# EAGLE design BEATS_3.6 (EAGLE 9.6.2)
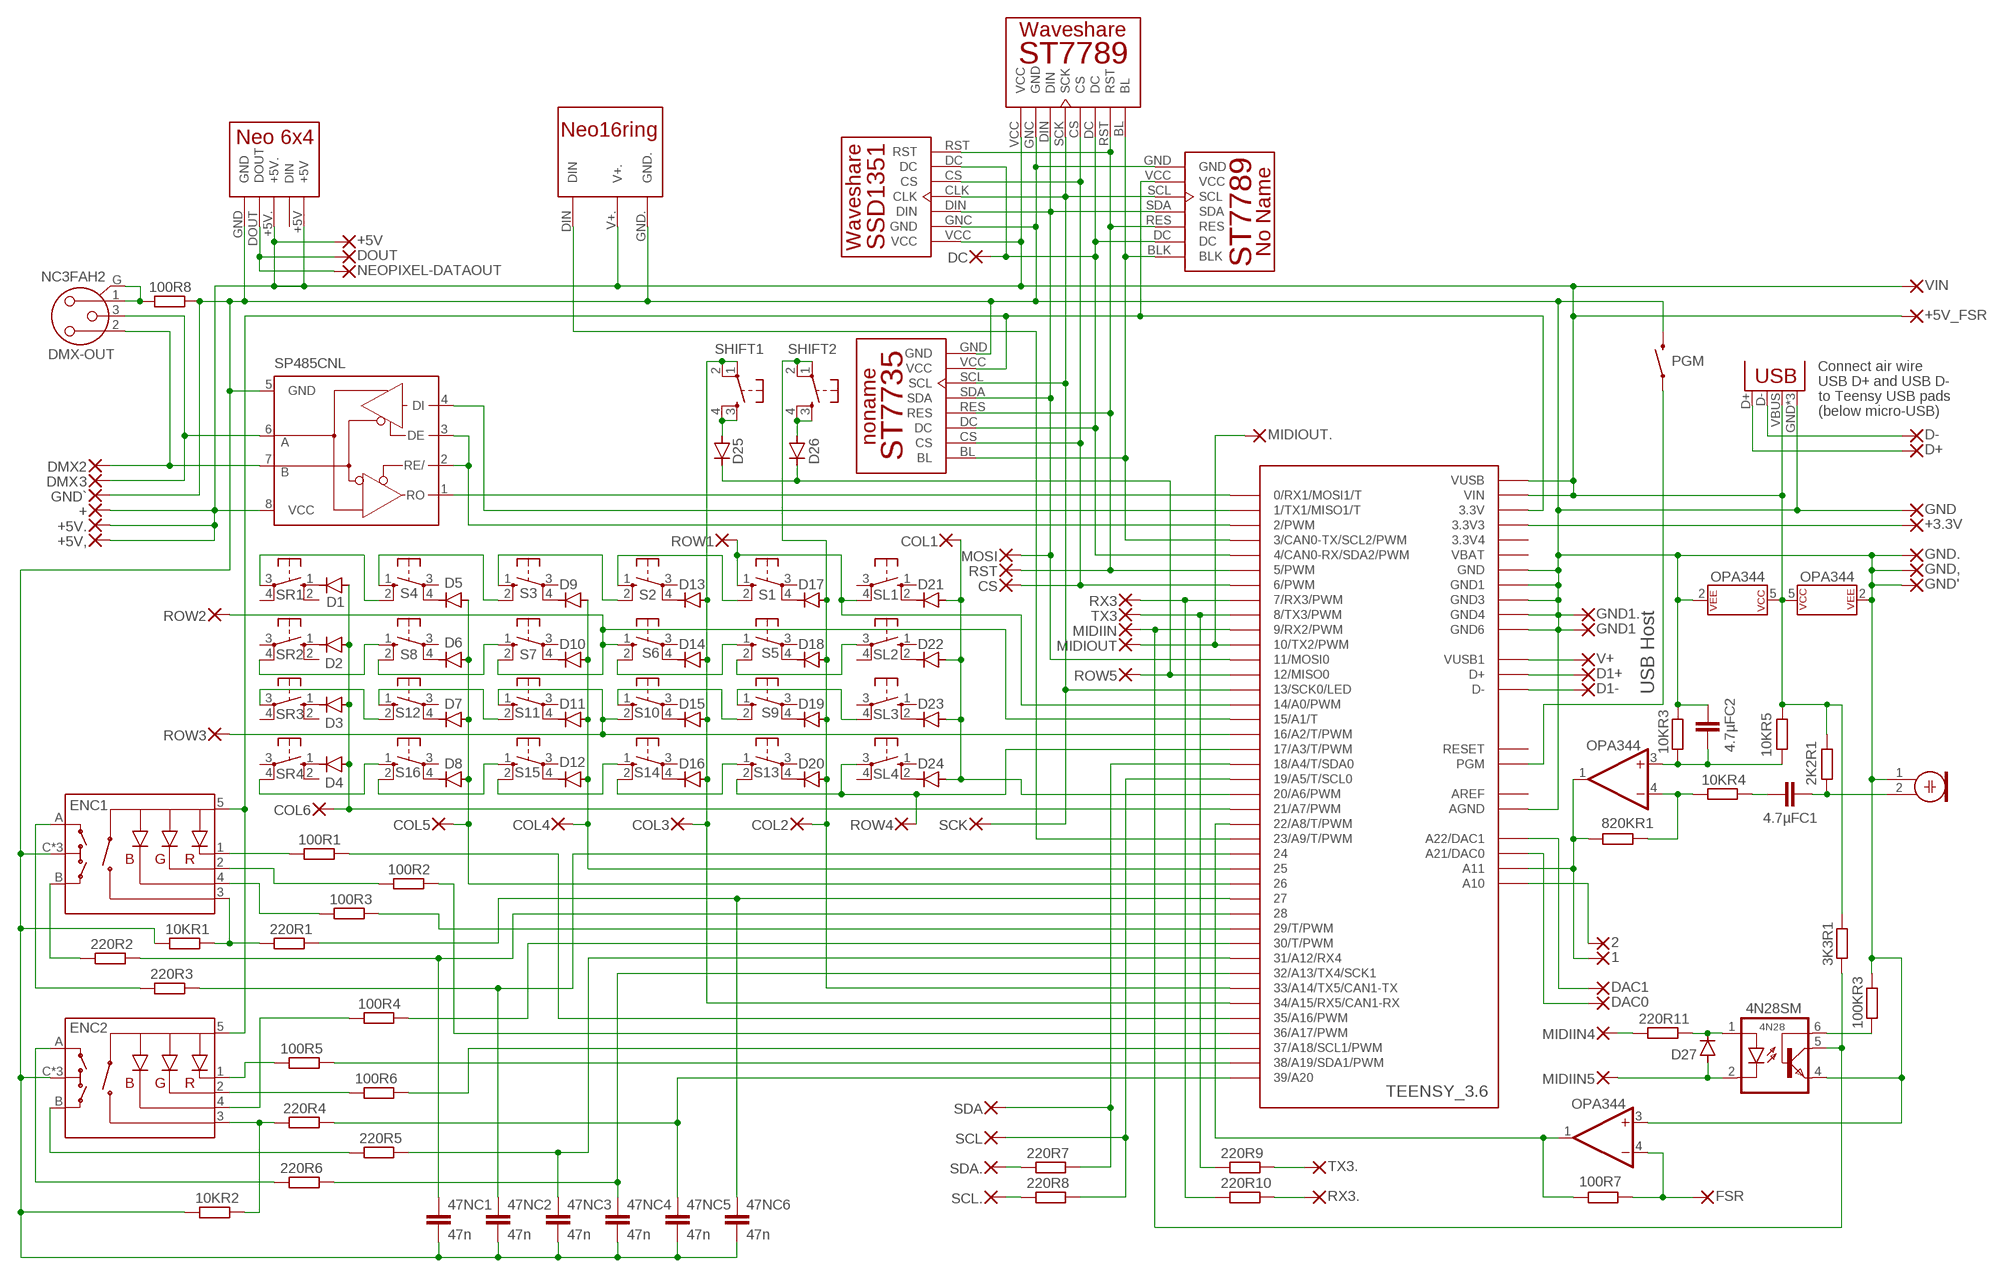
[diagram p0: schematic, sheet 1]

## Parts
1  1,6/0,8  [1,6/0,8]
2  1,6/0,8  [1,6/0,8]
2K2R1  2K2  R-EU_R0603  [R0603]
3  1,6/0,8  [1,6/0,8]
3K3R1  3k3  R-EU_R0603  [R0603]
4.7µFC1  4.7µF  C-EUC1210  [C1210]
4.7µFC2  4.7µF  C-EUC1210  [C1210]
4N28  4N28SM  [DIL6-SMD]
10KR1  10k  R-EU_R0603  [R0603]
10KR2  10k  R-EU_R0603  [R0603]
10KR3  10K  R-EU_R0603  [R0603]
10KR4  10K  R-EU_R0603  [R0603]
10KR5  10K  R-EU_R0603  [R0603]
47NC1  47n  C-EUC0603  [C0603]
47NC2  47n  C-EUC0603  [C0603]
47NC3  47n  C-EUC0603  [C0603]
47NC4  47n  C-EUC0603  [C0603]
47NC5  47n  C-EUC0603  [C0603]
47NC6  47n  C-EUC0603  [C0603]
100KR3  100k  R-EU_R0603  [R0603]
100R1  220R  R-EU_R0603  [R0603]
100R2  220R  R-EU_R0603  [R0603]
100R3  220R  R-EU_R0603  [R0603]
100R4  220R  R-EU_R0603  [R0603]
100R5  220R  R-EU_R0603  [R0603]
100R6  220R  R-EU_R0603  [R0603]
100R7  100R  R-EU_R0603  [R0603]
100R8  220R  R-EU_R0603  [R0603]
220R1  220R  R-EU_R0603  [R0603]
220R2  220R  R-EU_R0603  [R0603]
220R3  220R  R-EU_R0603  [R0603]
220R4  220R  R-EU_R0603  [R0603]
220R5  220R  R-EU_R0603  [R0603]
220R6  220R  R-EU_R0603  [R0603]
220R7  220R  R-EU_R0603  [R0603]
220R8  220R  R-EU_R0603  [R0603]
220R9  220R  R-EU_R0603  [R0603]
220R10  220R  R-EU_R0603  [R0603]
220R11  220R  R-EU_R0603  [R0603]
820KR1  820K  R-EU_R0603  [R0603]
+  1,6/0,8  [1,6/0,8]
+3.3V  +3.3v  1,6/0,8  [1,6/0,8]
+5V  1,6/0,8  [1,6/0,8]
+5V,  1,6/0,8  [1,6/0,8]
+5V.  1,6/0,8  [1,6/0,8]
+5V_FSR  1,6/0,8  [1,6/0,8]
COL1  1,6/0,8  [1,6/0,8]
COL2  1,6/0,8  [1,6/0,8]
COL3  1,6/0,8  [1,6/0,8]
COL4  1,6/0,8  [1,6/0,8]
COL5  1,6/0,8  [1,6/0,8]
COL6  1,6/0,8  [1,6/0,8]
CS  1,6/0,8  [1,6/0,8]
D1  1N4148DO34-5  [DO34-5]
D1+  1,6/0,8  [1,6/0,8]
D1-  1,6/0,8  [1,6/0,8]
D2  1N4148DO34-5  [DO34-5]
D3  1N4148DO34-5  [DO34-5]
D4  1N4148DO34-5  [DO34-5]
D5  1N4148DO34-5  [DO34-5]
D6  1N4148DO34-5  [DO34-5]
D7  1N4148DO34-5  [DO34-5]
D8  1N4148DO34-5  [DO34-5]
D9  1N4148DO34-5  [DO34-5]
D10  1N4148DO34-5  [DO34-5]
D11  1N4148DO34-5  [DO34-5]
D12  1N4148DO34-5  [DO34-5]
D13  1N4148DO34-5  [DO34-5]
D14  1N4148DO34-5  [DO34-5]
D15  1N4148DO34-5  [DO34-5]
D16  1N4148DO34-5  [DO34-5]
D17  1N4148DO34-5  [DO34-5]
D18  1N4148DO34-5  [DO34-5]
D19  1N4148DO34-5  [DO34-5]
D20  1N4148DO34-5  [DO34-5]
D21  1N4148DO34-5  [DO34-5]
D22  1N4148DO34-5  [DO34-5]
D23  1N4148DO34-5  [DO34-5]
D24  1N4148DO34-5  [DO34-5]
D25  1N4148DO34-5  [DO34-5]
D26  1N4148DO34-5  [DO34-5]
D27  1N4148DO34-5  [DO34-5]
D+  1,6/0,8  [1,6/0,8]
D-  1,6/0,8  [1,6/0,8]
DAC0  1,6/0,8  [1,6/0,8]
DAC1  1,6/0,8  [1,6/0,8]
DC  1,6/0,8  [1,6/0,8]
DMX2  1,6/0,8  [1,6/0,8]
DMX-OUT  NC3FAH2  [NC3FAH2]
DOUT  1,6/0,8  [1,6/0,8]
ENC1  ENCODER-RGB-SWITCHENCODER_LED_3_LONG  [ENCODER_LED_3_LONG]
ENC2  ENCODER-RGB-SWITCHENCODER_LED_3_LONG  [ENCODER_LED_3_LONG]
FSR  1,6/0,8  [1,6/0,8]
GND  1,6/0,8  [1,6/0,8]
GND1  1,6/0,8  [1,6/0,8]
GND1.  1,6/0,8  [1,6/0,8]
GND'  1,6/0,8  [1,6/0,8]
GND,  1,6/0,8  [1,6/0,8]
GND.  1,6/0,8  [1,6/0,8]
GND`  1,6/0,8  [1,6/0,8]
MIC  ELECTRET_MICROPHON-F6035AP  [F6035AP]
MIDIIN  1,6/0,8  [1,6/0,8]
MIDIIN4  1,6/0,8  [1,6/0,8]
MIDIIN5  1,6/0,8  [1,6/0,8]
MIDIOUT  1,6/0,8  [1,6/0,8]
MIDIOUT.  1,6/0,8  [1,6/0,8]
MOSI  1,6/0,8  [1,6/0,8]
NEOPIXEL-DATAOUT  1,6/0,8  [1,6/0,8]
OPA348,  OPA344  [SOT23-5]
OPA348.  OPA344  [SOT23-5]
PGM  MOMENTARY-SWITCH-SPST-SMD-4.6X2.8MM  [TACTILE_SWITCH_SMD_4.6X2.8MM]
ROW1  1,6/0,8  [1,6/0,8]
ROW2  1,6/0,8  [1,6/0,8]
ROW3  1,6/0,8  [1,6/0,8]
ROW4  1,6/0,8  [1,6/0,8]
ROW5  1,6/0,8  [1,6/0,8]
RST  1,6/0,8  [1,6/0,8]
RX3  1,6/0,8  [1,6/0,8]
RX3.  1,6/0,8  [1,6/0,8]
S1  10-XXLONG  [B3F-10XX]
S2  10-XXLONG  [B3F-10XX]
S3  10-XXLONG  [B3F-10XX]
S4  10-XXLONG  [B3F-10XX]
S5  10-XXLONG  [B3F-10XX]
S6  10-XXLONG  [B3F-10XX]
S7  10-XXLONG  [B3F-10XX]
S8  10-XXLONG  [B3F-10XX]
S9  10-XXLONG  [B3F-10XX]
S10  10-XXLONG  [B3F-10XX]
S11  10-XXLONG  [B3F-10XX]
S12  10-XXLONG  [B3F-10XX]
S13  10-XXLONG  [B3F-10XX]
S14  10-XXLONG  [B3F-10XX]
S15  10-XXLONG  [B3F-10XX]
S16  10-XXLONG  [B3F-10XX]
SCK  1,6/0,8  [1,6/0,8]
SCL  1,6/0,8  [1,6/0,8]
SCL.  1,6/0,8  [1,6/0,8]
SDA  1,6/0,8  [1,6/0,8]
SDA.  1,6/0,8  [1,6/0,8]
SHIFT1  MOMENTARY-SWITCH-SPST-2-SMD-5.2MM  [TACTILE_SWITCH_SMD_5.2MM]
SHIFT2  MOMENTARY-SWITCH-SPST-2-SMD-5.2MM  [TACTILE_SWITCH_SMD_5.2MM]
SL1  10-XXIN  [B3F-10XX1]
SL2  10-XXIN  [B3F-10XX1]
SL3  10-XXIN  [B3F-10XX1]
SL4  10-XXIN  [B3F-10XX1]
SP485CNL  MAX3468CSA  [SO08]
SR1  10-XXIN  [B3F-10XX1]
SR2  10-XXIN  [B3F-10XX1]
SR3  10-XXIN  [B3F-10XX1]
SR4  10-XXIN  [B3F-10XX1]
TEENSY_3.6  TEENSY_3.6_ALL_PINS  [TEENSY_3.6_ALL_PINS]
TX3  1,6/0,8  [1,6/0,8]
TX3.  1,6/0,8  [1,6/0,8]
U$1  WS_1.3"240X240_3.3V  [WS_1.3"240X240_3.3V]
U$2  WS_1.5"128X128_OLEDOLED  [WS_1.5"128X128_OLED]
U$3  WS_1.3"240X240ROUND  [WS_1.3"240X240_ROUND]
U$4  NEO16RING  [NEO16RING]
U$5  WS_1.44"128X128WS_1.44"128X128  [WS_1.44"128X128]
U$7  NEOPIXEL_6X4  [NEOPIXEL_6X4]
USB-B  USB-B-H  [USB-B-H]
V+  1,6/0,8  [1,6/0,8]
VIN  +3.3v  1,6/0,8  [1,6/0,8]

## Nets
3.3V: +3.3V.1(P) TEENSY_3.6.3.3V3
3V3: ENC1.5(+) ENC2.5(+) TEENSY_3.6.3.3V U$1.VCC U$5.VCC
AIN1: 1.1(P) 820KR1.1 OPA348..1(OUT) TEENSY_3.6.A11
AIN2: 2.1(P) TEENSY_3.6.A10
BL: TEENSY_3.6.3(3/CAN0-TX/SCL2/PWM) U$1.BLK U$3.BL U$5.BL
COL1: COL1.1(P) D21.A D22.A D23.A D24.A TEENSY_3.6.20/A6(20/A6/PWM)
COL2: COL2.1(P) D17.A D18.A D19.A D20.A SHIFT2.1 SHIFT2.2 TEENSY_3.6.33/A14(33/A14/TX5/CAN1-TX)
COL3: COL3.1(P) D13.A D14.A D15.A D16.A SHIFT1.1 SHIFT1.2 TEENSY_3.6.34/A15(34/A15/RX5/CAN1-RX)
COL4: COL4.1(P) D9.A D10.A D11.A D12.A TEENSY_3.6.25
COL5: COL5.1(P) D5.A D6.A D7.A D8.A TEENSY_3.6.26
COL6: COL6.1(P) D1.A D2.A D3.A D4.A TEENSY_3.6.21/A7(21/A7/PWM)
CS: CS.1(P) TEENSY_3.6.6(6/PWM) U$2.CS U$3.CS U$5.CS
D1+: D1+.1(P) TEENSY_3.6.D+
D1-: D1-.1(P) TEENSY_3.6.D-
D+: D+.1(P) USB-B.D+
D-: D-.1(P) USB-B.D-
DAC0: DAC0.1(P) TEENSY_3.6.A21(A21/DAC0)
DAC1: DAC1.1(P) TEENSY_3.6.A22(A22/DAC1)
DC: DC.1(P) TEENSY_3.6.4(4/CAN0-RX/SDA2/PWM) U$1.DC U$2.DC U$3.DC U$5.DC
DIN: MOSI.1(P) TEENSY_3.6.11(11/MOSI0) U$1.SDA U$2.DIN U$3.DIN U$5.SDA
DMXEN: SP485CNL.2(RE/) SP485CNL.3(DE) TEENSY_3.6.2(2/PWM)
DMXIN: SP485CNL.1(RO) TEENSY_3.6.0(0/RX1/MOSI1/T)
DMXIN.: DMX2.1(P) DMX-OUT.2 SP485CNL.7(B)
DMXOUT: SP485CNL.4(DI) TEENSY_3.6.1(1/TX1/MISO1/T)
DMXOUT.: 3.1(P) DMX-OUT.3 SP485CNL.6(A)
DOUT: DOUT.1(P) NEOPIXEL-DATAOUT.1(P) U$7.DOUT
ENC1A: 47NC2.1 220R3.2 TEENSY_3.6.24
ENC1A.: 220R3.1 ENC1.A
ENC1B: 47NC1.1 220R2.2 TEENSY_3.6.28
ENC1B.: 220R2.1 ENC1.B
ENC1BL: 100R3.2 TEENSY_3.6.29(29/T/PWM)
ENC1BL.: 100R3.1 ENC1.4(-B)
ENC1GN: 100R2.2 TEENSY_3.6.36/A17(36/A17/PWM)
ENC1GN.: 100R2.1 ENC1.2(-G)
ENC1RT: 100R1.2 TEENSY_3.6.35/A16(35/A16/PWM)
ENC1RT.: 100R1.1 ENC1.1(-R)
ENC1SW: 47NC6.1 220R1.2 TEENSY_3.6.27
ENC1SW.: 10KR1.2 220R1.1 ENC1.3(SW)
ENC2A: 47NC4.1 220R6.2 TEENSY_3.6.32/A13(32/A13/TX4/SCK1)
ENC2A.: 220R6.1 ENC2.A
ENC2B: 47NC3.1 220R5.2 TEENSY_3.6.31/A12(31/A12/RX4)
ENC2B.: 220R5.1 ENC2.B
ENC2BL: 100R4.2 TEENSY_3.6.30(30/T/PWM)
ENC2BL.: 100R4.1 ENC2.4(-B)
ENC2GN: 100R6.2 TEENSY_3.6.37/A18(37/A18/SCL1/PWM)
ENC2GN.: 100R6.1 ENC2.2(-G)
ENC2RT: 100R5.2 TEENSY_3.6.38/A19(38/A19/SDA1/PWM)
ENC2RT.: 100R5.1 ENC2.1(-R)
ENC2SW: 47NC5.1 220R4.2 TEENSY_3.6.39/A20
ENC2SW.: 10KR2.2 220R4.1 ENC2.3(SW)
FSR: 100R7.1 OPA348,.1(OUT) TEENSY_3.6.22/A8(22/A8/T/PWM)
GND.: 4.7µFC2.1 4N28.4(EMI) 10KR1.1 10KR2.1 10KR3.2 47NC1.2 47NC2.2 47NC3.2 47NC4.2 47NC5.2 47NC6.2 100KR3.2 100R8.2 ENC1.C ENC1.M1(C) ENC1.M2(C) ENC2.C ENC2.M1(C) ENC2.M2(C) GND1.1(P) GND1..1(P) GND'.1(P) GND,.1(P) GND.1(P) GND..1(P) GND`.1(P) MIC.1 OPA348,.2(P$V-) OPA348,.3(+IN) OPA348..2(P$V-) PGM.3 PGM.4 SP485CNL.5(GND) TEENSY_3.6.AGND TEENSY_3.6.GND TEENSY_3.6.GND1 TEENSY_3.6.GND3 TEENSY_3.6.GND4 TEENSY_3.6.GND6 U$1.GND U$2.GNC(GND) U$3.GNC(GND) U$4.GND. U$5.GND U$7.GND USB-B.GND USB-B.P$1(GND) USB-B.P$2(GND)
MIC: 2K2R1.1 4.7µFC1.2 MIC.2
MIDIIN: 3K3R1.2 4N28.5(COL) MIDIIN.1(P) TEENSY_3.6.9(9/RX2/PWM)
MIDIIN.: 4N28.2(C) D27.A MIDIIN5.1(P)
MIDIINGND: 4N28.1(A) 220R11.2 D27.C
MIDIOUT: MIDIOUT.1(P) MIDIOUT..1(P) TEENSY_3.6.10(10/TX2/PWM)
MISO: D25.C D26.C ROW5.1(P) TEENSY_3.6.12(12/MISO0)
N$1: 100R8.1 DMX-OUT.1 DMX-OUT.G
N$2: D1.C SR1.1(S)
N$3: D2.C SR2.1(S)
N$4: D3.C SR3.1(S)
N$5: 100R7.2 FSR.1(P) OPA348,.4(-IN)
N$6: D4.C SR4.1(S)
N$7: D5.C S4.4(P1)
N$8: D6.C S8.4(P1)
N$9: D7.C S12.4(P1)
N$10: D8.C S16.4(P1)
N$11: D9.C S3.4(P1)
N$12: D10.C S7.4(P1)
N$13: D11.C S11.4(P1)
N$14: D12.C S15.4(P1)
N$15: D13.C S2.4(P1)
N$16: D14.C S6.4(P1)
N$17: D15.C S10.4(P1)
N$18: D16.C S14.4(P1)
N$19: D17.C S1.4(P1)
N$20: D18.C S5.4(P1)
N$21: D19.C S9.4(P1)
N$22: D20.C S13.4(P1)
N$23: D21.C SL1.2(S1)
N$24: D22.C SL2.2(S1)
N$25: D23.C SL3.2(S1)
N$26: D24.C SL4.2(S1)
N$27: 4N28.6(BAS) 100KR3.1
N$28: 220R11.1 MIDIIN4.1(P)
N$29: D26.A SHIFT2.3 SHIFT2.4
N$30: D25.A SHIFT1.3 SHIFT1.4
N$51: 10KR4.1 820KR1.2 OPA348..4(-IN)
N$52: 4.7µFC1.1 10KR4.2
N$56: 4.7µFC2.2 10KR3.1 10KR5.1 OPA348..3(+IN)
NEO: TEENSY_3.6.23/A9(23/A9/T/PWM) U$4.DIN
PGM: PGM.1 PGM.2 TEENSY_3.6.PGM
ROW1: ROW1.1(P) S1.1(S) SL1.4(P1) TEENSY_3.6.14/A0(14/A0/PWM)
ROW1': S3.2(S1) S4.1(S)
ROW1,: S2.2(S1) S3.1(S)
ROW1.: S1.2(S1) S2.1(S)
ROW1`: S4.2(S1) SR1.3(P)
ROW2: S5.2(S1) SL2.3(P)
ROW2': S7.1(S) S8.2(S1)
ROW2,: ROW2.1(P) S6.1(S) S7.2(S1) TEENSY_3.6.15/A1(15/A1/T)
ROW2.: S5.1(S) S6.2(S1)
ROW2`: S8.1(S) SR2.4(P1)
ROW3: S9.1(S) SL3.4(P1)
ROW3': S11.2(S1) S12.1(S)
ROW3,: ROW3.1(P) S10.2(S1) S11.1(S) TEENSY_3.6.16/A2(16/A2/T/PWM)
ROW3.: S9.2(S1) S10.1(S)
ROW3`: S12.2(S1) SR3.3(P)
ROW4: ROW4.1(P) S13.2(S1) SL4.3(P) TEENSY_3.6.17/A3(17/A3/T/PWM)
ROW4': S15.1(S) S16.2(S1)
ROW4,: S14.1(S) S15.2(S1)
ROW4.: S13.1(S) S14.2(S1)
ROW4`: S16.1(S) SR4.4(P1)
RST: RST.1(P) TEENSY_3.6.5(5/PWM) U$1.RES U$2.RST U$3.RST U$5.RES
RX3: 220R10.1 RX3.1(P) TEENSY_3.6.7(7/RX3/PWM)
RX3.: 220R10.2 RX3..1(P)
SCK: SCK.1(P) TEENSY_3.6.13(13/SCK0/LED) U$1.SCL U$2.CLK U$3.SCK U$5.SCL
SCL: 220R8.2 SCL.1(P) TEENSY_3.6.19/A5(19/A5/T/SCL0)
SCL.: 220R8.1 SCL..1(P)
SDA: 220R7.2 SDA.1(P) TEENSY_3.6.18/A4(18/A4/T/SDA0)
SDA.: 220R7.1 SDA..1(P)
TX3: 220R9.1 TEENSY_3.6.8(8/TX3/PWM) TX3.1(P)
TX3.: 220R9.2 TX3..1(P)
V1: TEENSY_3.6.VUSB1 V+.1(P)
VUSB: 2K2R1.2 3K3R1.1 10KR5.2 +5V,.1(P) +5V.1(P) +5V..1(P) +5V_FSR.1(P) +.1(P) OPA348,.5(P$V+) OPA348..5(P$V+) SP485CNL.8(VCC) TEENSY_3.6.VIN TEENSY_3.6.VUSB U$2.VCC U$3.VCC U$4.V+. U$7.+5V U$7.+5V. USB-B.VBUS VIN.1(P)
Unconnected: S1.3(P) S2.3(P) S3.3(P) S4.3(P) S5.3(P) S6.3(P) S7.3(P) S8.3(P) S9.3(P) S10.3(P) S11.3(P) S12.3(P) S13.3(P) S14.3(P) S15.3(P) S16.3(P) SL1.1(S) SL1.3(P) SL2.1(S) SL2.4(P1) SL3.1(S) SL3.3(P) SL4.1(S) SL4.4(P1) SR1.2(S1) SR1.4(P1) SR2.2(S1) SR2.3(P) SR3.2(S1) SR3.4(P1) SR4.2(S1) SR4.3(P) TEENSY_3.6.RESET

## Notes on the sheet
- Connect air wire
- USB D+ and USB D-
- to Teensy USB pads
- (below micro-USB)
- DMX
- USB Host

## Power pins joined to a net without a drawn wire
3.3V4: TEENSY_3.6.3.3V4
AREF: TEENSY_3.6.AREF
VBAT: TEENSY_3.6.VBAT

## Library data of the parts
1-3 + +3.3V +5V +5V, +5V. +5V_FSR COL1-COL6 CS D1+ D1- D+ D- DAC0 DAC1 DC DMX2 DOUT FSR GND GND1 GND1. GND' GND, GND. GND` MIDIIN MIDIIN4 MIDIIN5 MIDIOUT MIDIOUT. MOSI NEOPIXEL-DATAOUT ROW1-ROW5 RST RX3 RX3. SCK SCL SCL. SDA SDA. TX3 TX3. V+ VIN = wirepad:1,6/0,8: THROUGH-HOLE PAD
2K2R1 10KR1 10KR2 100R7 = rcl:R-EU_: RESISTOR, European symbol; SPICEPREFIX: 2K2
3K3R1 = rcl:R-EU_: RESISTOR, European symbol; SPICEPREFIX: 3.3K
4.7µFC1 4.7µFC2 = rcl:C-EU: CAPACITOR, European symbol; SPICEPREFIX: C
4N28 = optocoupler:4N*?M: General Purpose 6-Pin Phototransistor Optocouplers Source: http://www.fairchildsemi.com/ds/4N/4N35-M.pdf; MF: FAIRCHILD SEMICONDUCTOR; MPN: 4N28S-M; OC_FARNELL: unknown; OC_NEWARK: 05C3314
10KR3-10KR5 = rcl:R-EU_: RESISTOR, European symbol; SPICEPREFIX: 10K
47NC1-47NC6 = rcl:C-EU: CAPACITOR, European symbol
100KR3 = rcl:R-EU_: RESISTOR, European symbol; SPICEPREFIX: 100K
100R1-100R6 100R8 220R1-220R11 = rcl:R-EU_: RESISTOR, European symbol; SPICEPREFIX: 220R
820KR1 = rcl:R-EU_: RESISTOR, European symbol; SPICEPREFIX: 820K
D1-D27 = diode:1N4148: DIODE high speed (Philips)
DMX-OUT = con-neutrik_ag:NC3: Neutrik Audio Connector XLR SERIES Stereo 1/4" jack Source: www.neutrik.com/; MPN: NC3FAH2; OC_FARNELL: unknown; OC_NEWARK: 27B4208
ENC1 ENC2 = SparkFun-Switches:ENCODER-RGB-SWITCH: Illuminated Rotary Encoder w/ RGB LED and select switch Encoders rotate similarly to potentiometers, but they’re different from potentiometers in that an encoder has full rotation without limits. They output gray code so that you can tell how much and in which direction the encoder has been turned. This encoder includes an RGB LED and a push-down select switch. Part #: Top Up EC12PLRGBSDVBF-D <http://top-up.so-buy.com/front/bin/ptdetail.phtml?Part=EC12PLRGBSDVBF-D> SparkFun Products Rotary Encoder - Illuminated (RGB) <https://www.sparkfun.com/products/10982> (COM-10982)
MIC = microphon:ELECTRET_MICROPHON-: Electret Condenser Microphone
OPA348, OPA348. = SparkFun-IC-Amplifiers:OPA344: Single gate rail-to-rail output op-amp. Inputs extend 300mV past rails. Datasheet <http://www.ti.com/product/OPA344> SparkFun Products SparkFun Low Current Sensor <https://www.sparkfun.com/products/8883> (SEN-08883) SparkFun Electret Microphone Breakout <https://www.sparkfun.com/products/12758> (BOB-12758); PROD_ID: IC-08251
PGM = SparkFun-Switches:MOMENTARY-SWITCH-SPST: Momentary Switch (Pushbutton) - SPST Normally-open (NO) SPST momentary switches (buttons, pushbuttons). Variants PTH-12MM - 12mm square, through-hole Momentary Pushbutton Switch - 12mm Square <https://www.sparkfun.com/products/9190> (COM-09190) PTH-6.0MM, PTH-6.0MM-KIT - 6.0mm square, through-hole Mini Pushbutton Switch <https://www.sparkfun.com/products/97> (COM-00097) KIT package intended for soldering kit's - only one side of pads' copper is exposed. PTH-RIGHT-ANGLE-KIT - Right-angle, through-hole Right Angle Tactile Button <https://www.sparkfun.com/products/10791> - Used on SparkFun BigTime Watch Kit <https://www.sparkfun.com/products/11734> SMD-12MM - 12mm square, surface-mount Tactile Button - SMD (12mm) <https://www.sparkfun.com/products/12993> (COM-12993) Used on SparkFun PicoBoard <https://www.sparkfun.com/products/11888> SMD-4.5MM - 4.5mm Square Trackball Switch Used on SparkFun Blackberry Trackballer Breakout <https://www.sparkfun.com/products/13169> SMD-4.6MMX2.8MM - 4.60mm x 2.80mm, surface mount Used on SparkFun SAMD21 Mini Breakout <https://www.sparkfun.com/products/13664> SMD-5.2MM, SMD-5.2-REDUNDANT - 5.2mm square, surface-mount Mini Pushbutton Switch - SMD <https://www.sparkfun.com/products/8720> (COM-08720) Used on Arduino Pro Mini <https://www.sparkfun.com/products/11114> REDUNDANT package connects both switch circuits together SMD-6.0X3.5MM - 6.0 x 3.5mm, surface mount Momentary Reset Switch SMD <https://www.sparkfun.com/products/8229> (COM-08229) SMD-6.2MM-TALL - 6.2mm square, surface mount Tactile Button - SMD (6mm) <https://www.sparkfun.com/products/12992> Used on SparkFun Digital Sandbox <https://www.sparkfun.com/products/12651> SMD-RIGHT-ANGLE - Right-angle, surface mount Used on SparkFun Block for Intel® Edison - Arduino <https://www.sparkfun.com/products/13036>; PROD_ID: SWCH-13065
S1-S16 = switch:10-XX: OMRON SWITCH; MPN: B3F-1000; OC_FARNELL: 176432; OC_NEWARK: 36M3542
SHIFT1 SHIFT2 = SparkFun-Switches:MOMENTARY-SWITCH-SPST-2: Momentary Switch (Pushbutton) - SPST - Two Circuits Normally-open (NO) SPST momentary switches (buttons, pushbuttons). Schematic symbol includes two switch circuits. Variants SMD-4.6MMX2.8MM - 4.60mm x 2.80mm Tactile Momentary Button Switch - Used on SparkFun SAMD21 Mini Breakout <https://www.sparkfun.com/products/13664> SMD-5.2MM - Mini Pushbutton Switch - SMD <https://www.sparkfun.com/products/8720> - Used on Arduino Pro Mini <https://www.sparkfun.com/products/11114>; PROD_ID: SWCH-08247; SF_SKU: COM-08720
SL1-SL4 SR1-SR4 = switch:10-XX: OMRON SWITCH
SP485CNL = maxim:MAX34*: +5V, Fail-Safe, 40Mbps, Profibus RS-485/RS-422 Transceivers Source: MAX3465-MAX3469.pdf; MPN: MAX3468CSA+; OC_FARNELL: unknown; OC_NEWARK: 76K6721
TEENSY_3.6 = Teensy_3_and_LC_Series_Boards_v1.4:TEENSY_3.6_ALL_PINS: All PIN version of the Teensy 3.6.
U$1 = WS_1.3-240x240:WS_1.3"240X240_3.3V
U$2 = WS_1.3-240x240:WS_1.5"128X128_OLED
U$3 = WS_1.3-240x240:WS_1.3"240X240
U$4 = Neo16ring3:NEO16RING
U$5 = WS_1.3-240x240:WS_1.44"128X128
U$7 = neopixel_6x4:NEOPIXEL_6X4
USB-B = con-usb:USB: USB Connectors

## Board
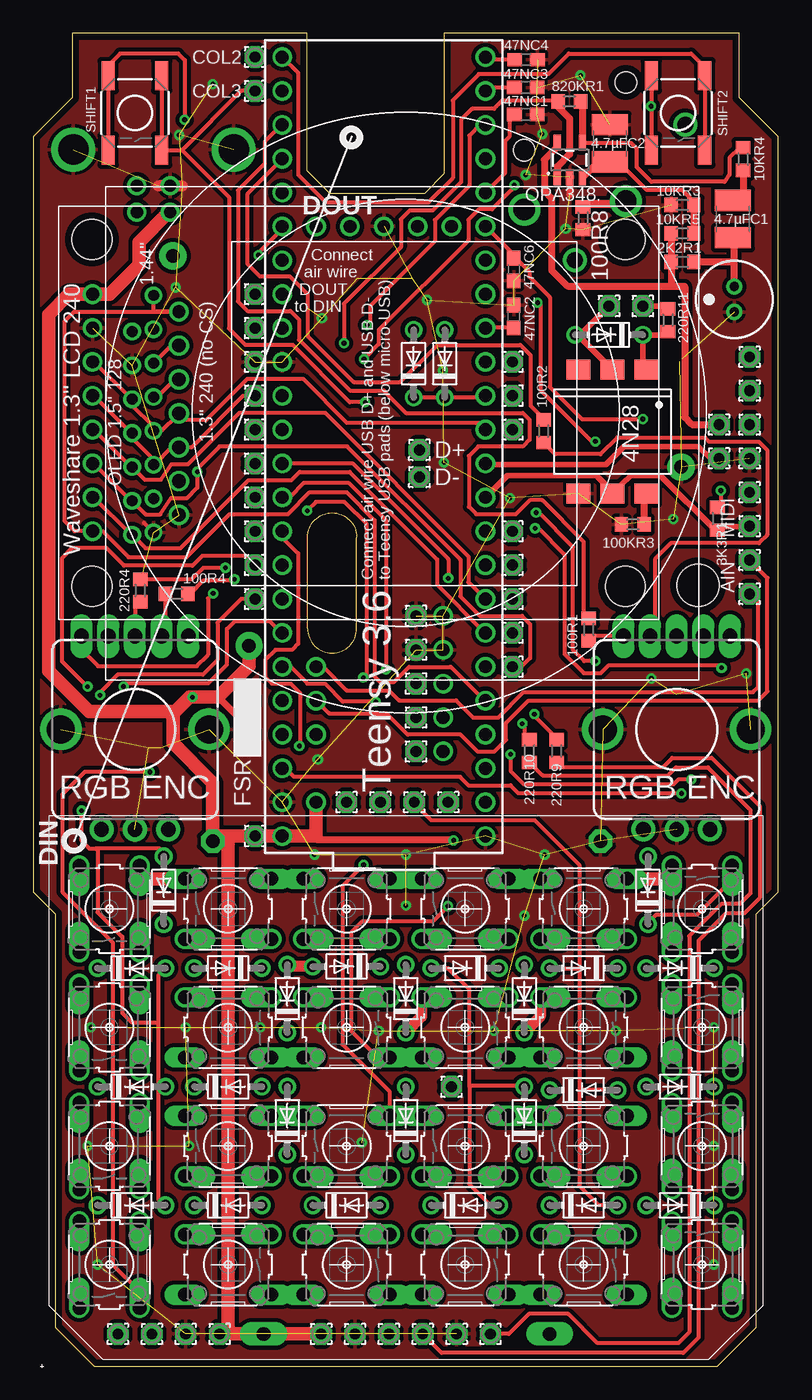
[diagram p1: board, top side]
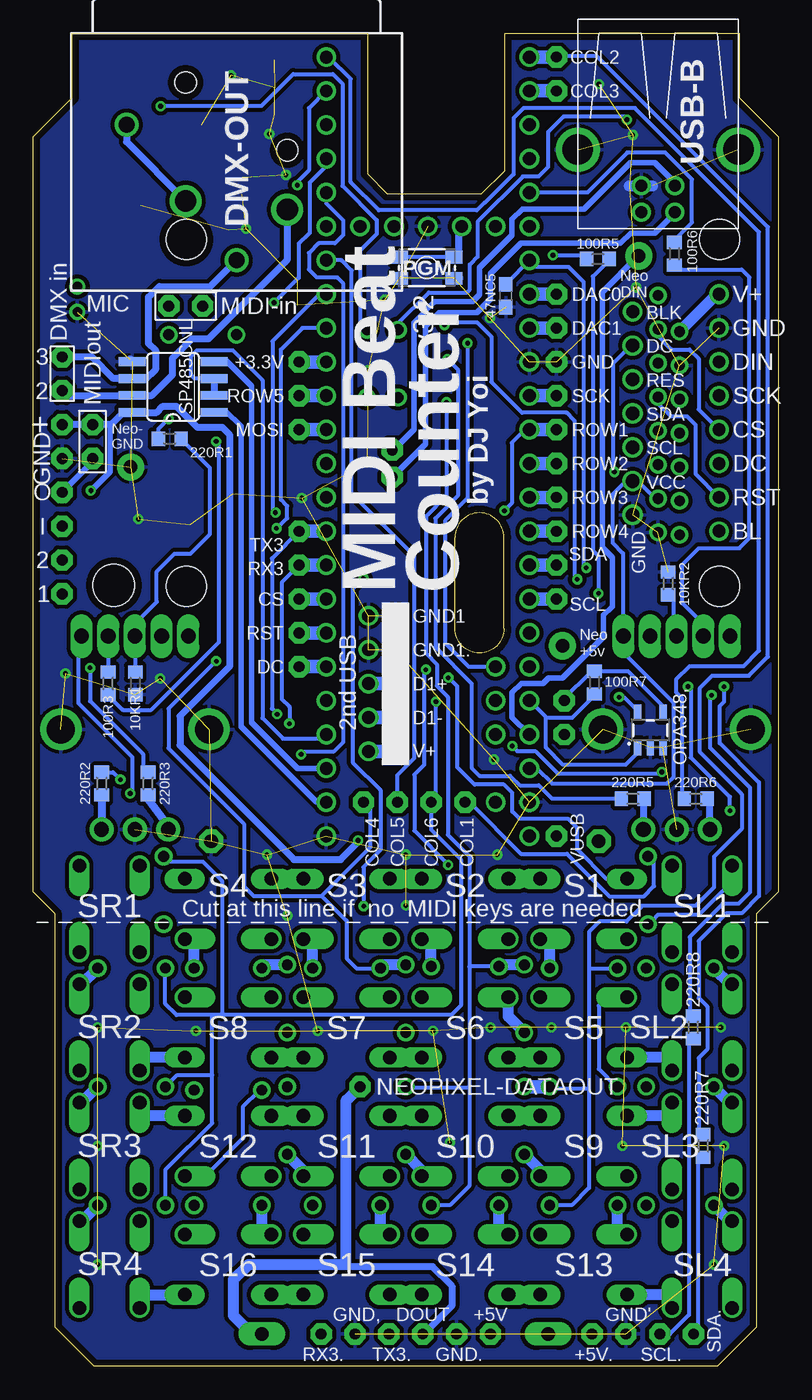
[diagram p2: board, bottom side, seen from below]

Size 55.88 x 99.95 mm. Coordinates in mm from the lower left corner, seen from the top.
Outline: 1.65,2.92 4.57,0 51.31,0 54.23,2.92 54.23,33.91 55.88,35.56 55.88,92.2 52.96,95.12 52.96,99.95 30.81,99.95 30.81,89.41 29.34,87.94 22.25,87.94 20.52,89.66 20.52,99.95 2.92,99.95 2.92,95.12 0,92.2 0,35.56 1.65,33.91 1.65,2.92
Outline: 20.57,55.32 arc180 24.26,55.32 24.26,62.15 arc180 20.57,62.15 20.57,55.32
Copper layers (1*16): Top 0.035mm / dielectric 1.5mm / Bottom 0.035mm
Design rules "default *": minimum track width 12mil, minimum drill 0.35mm, track to track 12mil, track to pad 12mil, pad to pad 12mil, via to via 12mil, smd to smd 12mil, copper to edge 20mil, drill to drill 12mil, minimum pad ring 10mil, minimum via ring 8mil, stop-mask expansion 4mil, vias tented up to drill 0mil, thermal gap 10mil
Holes 3.15 mm at 49.85,58.55

### Footprints (pad centres in the part's own frame; a part is rotated, then mirrored left to right if it is on the bottom)
1,6/0,8 = drill 0.813 pad 1.6 octagon: 1 0,0
R0603 = smd 1 x 1.1: 1 -0.85,0; 2 0.85,0
C1210 = smd 1.6 x 2.7: 1 -1.4,0; 2 1.4,0
DIL6-SMD = smd 1.78 x 1.52: 1 -2.54,-4.645; 2 0,-4.645; 3 2.54,-4.645; 4 2.54,4.645; 5 0,4.645; 6 -2.54,4.645
C0603 = smd 1.1 x 1: 1 -0.85,0; 2 0.85,0
DO34-5 = drill 0.813: A 2.54,0; C -2.54,0
NC3FAH2 = drill 1.6: 1 -3.81,0.635; 2 3.81,0 | drill 1.2: 3 0,-3.815; G -8.25,6.355 | hole 1.6: -3.81,9.525; 3.81,4.445
ENCODER_LED_3_LONG = drill 1.1 pad 1.65 long: 1 -4,7; 2 -2,7; 3 0,7; 4 2,7; 5 4,7 | drill 1.1 pad 1.8: A -2.5,-7.5; B 2.5,-7.5; C 0,-7.5 | drill 2.1: M1 -5.55,0; M2 5.55,0
F6035AP = drill 0.7 pad 1.2: 1 0,0.95; 2 0,-0.95
SOT23-5 = smd 0.55 x 1.2: 1 -0.95,-1.3; 2 0,-1.3; 3 0.95,-1.3; 4 0.95,1.3; 5 -0.95,1.3
TACTILE_SWITCH_SMD_4.6X2.8MM = smd 1.27 x 0.965: 1 -2.05,-0.8; 2 2.05,-0.8; 3 2.05,0.8; 4 -2.05,0.8
B3F-10XX = drill 1.016 long: 1 -3.251,2.261; 2 3.251,2.261 | drill 1.016 offset: 3 -3.251,-2.261; 4 3.251,-2.261
TACTILE_SWITCH_SMD_5.2MM = smd 2.2 x 1: 1 -2.794,2; 2 2.794,2; 3 -2.794,-2; 4 2.794,-2
B3F-10XX1 = drill 1.016 offset: 1 -3.251,2.261; 2 3.251,2.261; 3 -3.251,-2.261; 4 3.251,-2.261
SO08 = smd 0.66 x 2.032: 1 -1.905,-3.073; 2 -0.635,-3.073; 3 0.635,-3.073; 4 1.905,-3.073; 5 1.905,3.073; 6 0.635,3.073; 7 -0.635,3.073; 8 -1.905,3.073
TEENSY_3.6_ALL_PINS = drill 0.965: 0 -7.62,25.4; 1 -7.62,22.86; 2 -7.62,20.32; 3 -7.62,17.78; 3.3V 7.62,22.86; 3.3V3 -7.62,-7.62; 3.3V4 -2.54,-17.78; 4 -7.62,15.24; 5 -7.62,12.7; 6 -7.62,10.16; 7 -7.62,7.62; 8 -7.62,5.08; 9 -7.62,2.54; 10 -7.62,0; 11 -7.62,-2.54; 12 -7.62,-5.08; 13 7.62,-5.08; 14/A0 7.62,-2.54; 15/A1 7.62,0; 16/A2 7.62,2.54; 17/A3 7.62,5.08; 18/A4 7.62,7.62; 19/A5 7.62,10.16; 20/A6 7.62,12.7; 21/A7 7.62,15.24; 22/A8 7.62,17.78; 23/A9 7.62,20.32; 24 -7.62,-10.16; 25 -7.62,-12.7; 26 -7.62,-15.24; 27 -7.62,-17.78; 28 -7.62,-20.32; 29 -7.62,-22.86; 30 -7.62,-25.4; 31/A12 -7.62,-27.94; 32/A13 -7.62,-30.48; 33/A14 7.62,-30.48; 34/A15 7.62,-27.94; 35/A16 7.62,-25.4; 36/A17 7.62,-22.86; 37/A18 7.62,-20.32; 38/A19 7.62,-17.78; 39/A20 7.62,-15.24; A10 5.08,17.78; A11 5.08,15.24; A21 7.62,-12.7; A22 7.62,-10.16; AGND 7.62,25.4; AREF 5.08,20.32; D+ -4.445,16.51; D- -4.445,19.05; GND -7.62,27.94; GND1 7.62,-7.62; GND3 -4.445,13.97; GND4 -4.445,11.43; GND6 0,-17.78; PGM 2.54,-17.78; RESET 5.08,-17.78; VBAT -5.08,-17.78; VIN 7.62,27.94; VUSB 5.08,25.4; VUSB1 -4.445,21.59
WS_1.3"240X240_3.3V = drill 0.965: BLK 6.27,1.27 | drill 1.016: DC 8.81,1.27; GND 21.51,1.27; RES 11.35,1.27; SCL 16.43,1.27; SDA 13.89,1.27; VCC 18.97,1.27
WS_1.5"128X128_OLED = drill 0.813 pad 1.118: CLK 18.5,2; CS 21.04,2; DC 23.58,2; DIN 15.96,2; GNC 13.42,2; RST 26.12,2; VCC 10.88,2
WS_1.3"240X240_ROUND = drill 0.965: BL 24.384,2.54; CS 16.764,2.54; DC 19.304,2.54; DIN 11.684,2.54; GNC 9.144,2.54; RST 21.844,2.54; SCK 14.224,2.54; VCC 6.604,2.54 | hole 3: 2.5,2.5; 28.5,2.5; 28.5,42.5; 2.5,42.5
NEO16RING = drill 1.016 pad 2.032: DIN 7.925,37.16; GND. 46.05,21.336; V+. 13.64,7.925
WS_1.44"128X128 = drill 0.813 pad 1.118: BL 6.11,1.5; CS 8.65,1.5; DC 11.19,1.5; GND 23.89,1.5; RES 13.73,1.5; SCL 18.81,1.5; SDA 16.27,1.5; VCC 21.35,1.5
NEOPIXEL_6X4 = drill 1.016 pad 1.778 octagon: +5V 12.827,39.37; GND 41.91,39.37 | drill 1.016 pad 1.778 long: +5V. 16.637,2.413; DOUT 38.1,2.413
USB-B-H = drill 0.914: D+ 0,1.25; D- 1.981,1.25; GND 0,-1.25; VBUS 1.981,-1.25 | drill 2.286: P$1 -2.718,-6.02; P$2 -2.718,6.02

### Placement (x,y rotation side)
1  53.72,57.91 0 top
2  53.72,60.45 0 top
2K2R1  48.69,82.8 180 top
3  53.72,75.69 0 top
3K3R1  51.31,63.55 270 top
4.7µFC1  52.48,86.03 270 top
4.7µFC2  43.26,91.69 270 top
4N28  43.43,70.08 180 top
10KR1  48.23,51.21 90 bottom
10KR2  8.26,58.7 270 bottom
10KR3  48.69,87.07 180 top
10KR4  53.24,90.53 270 top
10KR5  48.69,84.94 180 top
47NC1  36.93,93.85 0 top
47NC2  36.04,78.71 90 top
47NC3  36.93,95.89 0 top
47NC4  36.96,97.97 0 top
47NC5  20.45,80.26 270 bottom
47NC6  36.04,82.25 270 top
100KR3  44.96,63.12 180 top
100R1  41.66,55.24 90 top
100R2  38.28,70.1 90 top
100R3  50.27,51.21 270 bottom
100R4  10.74,57.91 0 top
100R5  13.54,83.03 180 bottom
100R6  7.8,83.41 90 bottom
100R7  13.79,51.26 90 bottom
100R8  41.22,86.08 270 top
220R1  45.64,69.55 180 bottom
220R2  50.75,43.69 90 bottom
220R3  47.27,43.69 90 bottom
220R4  8.03,58.17 90 top
220R5  10.92,42.55 180 bottom
220R6  6.2,42.55 180 bottom
220R7  5.64,16.51 90 bottom
220R8  6.38,25.4 90 bottom
220R9  39.24,46.13 270 top
220R10  37.21,46.13 270 top
220R11  47.6,78.44 270 top
820KR1  40.21,94.84 0 top
+  53.72,70.61 0 top
+3.3V  35.94,75.31 0 top
+5V  21.59,2.41 0 top
+5V,  51.44,70.61 0 top
+5V.  13.97,2.41 0 top
+5V_FSR  16.05,47.37 0 top
COL1  23.5,42.29 0 top
COL2  16.64,98.17 0 top
COL3  16.64,95.63 0 top
COL4  31.11,42.29 0 top
COL5  28.57,42.29 0 top
COL6  26.04,42.29 0 top
CS  35.94,57.53 0 top
D1  46.1,35.69 90 top
D1+  28.7,51.18 0 top
D1-  28.7,48.64 0 top
D2  48.51,29.84 180 top
D3  48.51,20.95 180 top
D4  48.51,12.06 180 top
D5  41.27,29.84 180 top
D6  36.83,27.56 90 top
D7  41.27,20.7 0 top
D8  41.27,12.06 0 top
D9  32.38,29.84 180 top
D10  27.94,27.56 90 top
D11  36.83,18.41 90 top
D12  32.38,12.06 0 top
D13  23.5,29.97 180 top
D14  19.05,27.56 90 top
D15  27.94,18.41 90 top
D16  23.5,12.06 0 top
D17  14.61,29.84 180 top
D18  14.61,20.95 0 top
D19  19.05,18.41 90 top
D20  14.61,12.06 0 top
D21  9.78,35.69 90 top
D22  7.37,29.84 0 top
D23  7.37,20.95 0 top
D24  7.37,12.06 0 top
D25  28.52,75.18 90 top
D26  30.86,75.18 90 top
D27  43.18,77.34 180 top
D+  28.96,68.71 0 top
D-  28.96,66.67 0 top
DAC0  16.64,80.39 0 top
DAC1  16.64,77.85 0 top
DC  35.94,52.45 0 top
DMX2  53.72,73.15 0 top
DMX-OUT  40.64,86.74 0 bottom
DOUT  26.67,2.41 0 top
ENC1  48.26,47.75 0 top
ENC2  7.62,47.75 0 top
FSR  16.05,49.91 0 top
GND  16.64,75.31 0 top
GND1  28.7,56.26 0 top
GND1.  28.7,53.72 0 top
GND'  11.43,2.41 0 top
GND,  31.75,2.41 0 top
GND.  24.13,2.41 0 top
GND`  53.72,68.07 0 top
MIC  52.58,80.01 180 top
MIDIIN  53.72,62.99 0 top
MIDIIN4  45.72,79.5 0 top
MIDIIN5  43.18,79.5 0 top
MIDIOUT  53.72,65.53 0 top
MIDIOUT.  51.44,68.07 0 top
MOSI  35.94,70.23 0 top
NEOPIXEL-DATAOUT  31.37,20.95 0 top
OPA348,  9.6,47.7 0 bottom
OPA348.  40.23,90.45 0 top
PGM  26.37,82.37 180 bottom
ROW1  16.64,70.23 0 top
ROW2  16.64,67.69 0 top
ROW3  16.64,65.15 0 top
ROW4  16.64,62.61 0 top
ROW5  35.94,72.77 0 top
RST  35.94,54.99 0 top
RX3  35.94,60.07 0 top
RX3.  34.29,2.41 0 top
S1  14.61,34.29 0 top
S2  23.5,34.29 0 top
S3  32.38,34.29 0 top
S4  41.27,34.29 0 top
S5  14.61,25.4 180 top
S6  23.5,25.4 180 top
S7  32.38,25.4 180 top
S8  41.27,25.4 180 top
S9  14.61,16.51 0 top
S10  23.5,16.51 0 top
S11  32.38,16.51 0 top
S12  41.27,16.51 0 top
S13  14.61,7.62 180 top
S14  23.5,7.62 180 top
S15  32.38,7.62 180 top
S16  41.27,7.62 180 top
SCK  16.64,72.77 0 top
SCL  16.64,57.53 0 top
SCL.  8.89,2.41 0 top
SDA  16.64,60.07 0 top
SDA.  6.35,2.41 0 top
SHIFT1  7.62,93.98 270 top
SHIFT2  48.36,93.98 270 top
SL1  5.71,34.29 90 top
SL2  5.71,25.4 90 top
SL3  5.71,16.51 90 top
SL4  5.71,7.62 90 top
SP485CNL  45.39,73.43 90 bottom
SR1  50.16,34.29 270 top
SR2  50.16,25.4 270 top
SR3  50.16,16.51 270 top
SR4  50.16,7.62 270 top
TEENSY_3.6  26.29,67.69 180 top
TX3  35.94,62.61 0 top
TX3.  29.21,2.41 0 top
U$1  9.65,85.34 270 top
U$2  5.41,88.47 270 top
U$3  1.91,87 270 top
U$4  2.54,46.1 0 top
U$5  7.52,86.41 270 top
U$7  0.64,0 0 top
USB-B  9.02,88.52 270 bottom
V+  28.7,46.1 0 top
VIN  16.64,39.75 0 top

### Tracks (layer width: path | path; a pad name or v marks a point on that pad's centre or on a via)
3.3V
  Bottom 1.016: TEENSY_3.6.3.3V3 +3.3V.1
3V3  (via drill 0.35)
  Top 0.305: TEENSY_3.6.3.3V 18.92,44.83 19.56,44.2 32,44.2 32.64,43.56 35.79,43.56 36.4,42.95 v48.62,42.95
  Bottom 0.305: TEENSY_3.6.3.3V 18.11,44.83 16.96,43.68 8.34,43.68 7.86,44.16 7.86,49.75 11.61,53.5 11.61,54.75 ENC2.5 11.64,54.78 11.64,60.95 12.45,61.75 12.45,65.36 11.43,66.37 U$1.VCC 10.54,66.37 9.23,65.06 U$5.VCC | ENC1.5 52.51,54.5 52.51,49.72 48.46,45.67 48.46,42.95 v48.62,42.95
AIN1  (via drill 0.35)
  Top 0.305: 820KR1.1 39.38,94.82 39.59,94.82 39.52,94.89 35.16,94.89 34.56,94.28 32.91,94.28 32.08,93.46 32.08,88.8 29.95,86.67 28.23,86.67 27.57,86.01 27.57,83.93 23.3,79.66 v23.3,76.71 | OPA348..1 39.3,89.16 | 1.1 54.1,57.91 54.38,57.64 54.38,50.95 53.98,50.55 36.78,50.55 34.87,48.64 32.99,48.64 31.71,49.92 27.43,49.92 26.68,50.67 23.5,50.67 21.72,52.45 TEENSY_3.6.A11
  Top 0.508: 820KR1.1 39.36,94.44 40.22,93.58 40.22,90.89 39.3,89.96 39.3,89.16
  Bottom 0.305: TEENSY_3.6.A11 23.23,52.45 24.99,54.21 24.99,63.4 23.3,65.09 v23.3,76.71
AIN2
  Top 0.305: 2.1 55.06,59.11 55.06,50.6 54.37,49.91 37.14,49.91 35.46,48.23 35.46,46.96 34.59,46.1 33.31,46.1 32.05,47.36 28.07,47.36 26.48,48.95 22.2,48.95 21.23,49.91 TEENSY_3.6.A10
BL
  Top 0.305: TEENSY_3.6.3 33.87,49.87 31.29,52.45 31.28,52.44 28.18,52.44 27.05,51.31 26.01,51.31 25.6,51.71 25.6,63.42 23.5,65.53 20.74,65.53 19.1,63.89 14.72,63.89 11.5,60.67 7.15,60.67 5.21,62.61 U$3.BL 3.1,62.61 2.34,63.38 2.34,78.36 3.05,79.07 U$1.BLK 9.02,79.07 U$5.BL
COL1  (via drill 0.35)
  Top 0.305: v6.77,50.97 6.72,50.97 6.72,51.2 13.12,51.2 14.53,52.6 14.53,55.3 15.13,55.89 17.74,55.89 18.54,55.09 18.57,55.09 TEENSY_3.6.20/A6 | v3.62,41.66 3.64,41.64 3.64,39.38 4.2,38.82 4.68,38.82 | D21.A 9.78,38.53 9.49,38.82 4.68,38.82 | 9.37,25.78 7.37,25.78 6.67,26.48 6.67,32.19 4.83,34.04 4.83,38.68 4.68,38.82 | D22.A 9.37,29.31 9.37,25.78 | 9.37,25.78 9.37,20.98 9.4,20.95 | D23.A 9.4,20.95 | 9.4,20.95 9.37,20.93 9.37,12.52 D24.A
  Bottom 0.305: v6.77,50.97 6.69,51.05 6.57,51.05 6.57,45.64 3.62,42.69 v3.62,41.66 | COL1.1 23.18,42.29 19.3,38.42 15.85,38.42 12.68,35.24 10.08,35.24 9.32,36.01 9.32,38.04 D21.A
COL2
  Top 0.305: TEENSY_3.6.33/A14 19.86,96.98 19.86,89.33 21.92,87.27 29.64,87.27 31.47,89.1 31.47,94.93 33.42,96.88 38.62,96.88 40.16,98.42 49.35,98.42 50.36,97.41 SHIFT2.1 SHIFT2.2
  Bottom 0.305: TEENSY_3.6.33/A14 18.58,98.26 13.63,98.26 0.79,85.42 0.79,53.21 2.21,51.79 4.95,51.79 5.88,50.86 5.88,46.05 2.74,42.91 2.74,40.28 4.83,38.2 4.83,35.92 6.21,34.53 10.2,34.53 11.38,33.35 13.41,33.35 14.2,32.56 14.2,29.84 | D20.A 15.49,12.06 14.2,13.36 14.2,20.83 | 14.2,29.84 14.2,20.83 | D18.A 17.02,20.83 14.2,20.83 | 14.2,29.84 D17.A
  Bottom 1.016: COL2.1 TEENSY_3.6.33/A14 | D18.A D19.A
COL3  (via drill 0.35)
  Top 0.305: 11.14,91.19 15.6,95.64 16.5,95.64 COL3.1 | v24.89,72.29 23.74,72.29 19.43,76.59 15.89,76.59 14.68,77.81 14.68,87.68 11.18,91.19 11.14,91.19 | D13.A 20.94,29.96 | 11.14,91.19 SHIFT1.2 SHIFT1.1
  Top 0.813: 20.94,29.96 19.19,29.96 D14.A
  Bottom 0.305: 24.77,72.19 24.87,72.29 v24.89,72.29 24.89,65.28 26.44,63.73 26.44,53.47 25.61,52.63 25.61,51.01 24.78,50.18 24.78,39.84 23.18,38.24 23.18,29.97 | D16.A 24.64,12.06 23.18,13.53 23.18,20.89 | 23.18,20.89 27.94,20.89 D15.A | 23.18,29.97 23.18,20.89 | D13.A 21.21,29.97 23.18,29.97
  Bottom 0.813: D14.A 21.08,30.1 21.21,29.97
  Bottom 1.016: COL3.1 TEENSY_3.6.34/A15
COL4  (via drill 0.35)
  Top 0.305: v42.16,52.87 41.32,52.87 40.49,53.7 40.49,61.44 37.92,64.01 v37.72,64.01 | 32.7,21.02 32.7,13.65 34.29,12.06 D12.A | D11.A 36.77,21.02 32.7,21.02 | 32.7,21.02 32.7,28.26 31.11,29.84 D9.A
  Bottom 0.305: v42.16,52.87 42.18,52.87 45.74,49.3 45.74,46.33 40.08,40.66 40.08,35.99 39.34,35.26 34.27,35.26 34.25,35.27 | v37.72,64.01 37.95,64.01 37.95,76.86 34.42,80.39 TEENSY_3.6.25 | 30.18,29.84 D9.A 31.65,29.84 32.38,30.58 32.38,33.4 34.25,35.27 | COL4.1 30.61,41.78 30.61,38.91 34.25,35.27
  Bottom 0.813: D10.A 29.59,30.1 D9.A
COL5
  Top 0.305: D8.A 42.42,12.06 40.96,13.53 40.96,20.71 | D7.A 40.96,20.71 | COL5.1 28.57,42.23 29.84,40.96 37.59,40.96 40.96,37.59 40.96,29.84 | 40.96,29.84 40.96,20.71 | D5.A 40.96,29.84
  Bottom 0.305: COL5.1 28.57,44.32 27.3,45.59 27.3,60.74 32,65.44 32,82.17 32.77,82.93 TEENSY_3.6.26
  Bottom 0.813: D6.A 38.48,30.1 D5.A
COL6  (via drill 0.35)
  Top 0.305: v25.68,49.84 23.21,49.84 21.86,51.18 20.56,51.18 19.29,52.45 TEENSY_3.6.21/A7
  Bottom 0.305: D1.A 45.72,37.85 43.18,37.85 41.72,36.39 41.72,26.34 | D4.A 45.97,14.71 42.46,18.22 42.46,21.84 | D3.A 45.09,21.84 42.46,21.84 | D2.A 45.97,27.18 45.14,26.34 42.42,26.34 | 41.72,26.34 24.52,26.34 23.81,27.05 23.81,38.01 26.04,40.23 COL6.1 25.73,42.6 25.73,49.78 v25.68,49.84 | 41.72,26.34 42.42,26.34 | 42.46,21.84 42.46,26.3 42.42,26.34
CS
  Top 0.305: U$3.CS 4.53,70.23 7.33,67.43 U$2.CS 8.37,66.47 9.56,66.47 10.34,67.64 11.61,67.64 15.47,71.5 21.87,71.5 32.64,60.73 32.64,58.8 TEENSY_3.6.6
  Bottom 0.305: U$5.CS 9.11,77.67 9.11,77.35 8.01,76.24 6.66,76.24 5.96,75.54 5.96,71.75 U$3.CS
  Bottom 1.016: TEENSY_3.6.6 CS.1
D1+
  Bottom 1.016: D1+.1 TEENSY_3.6.D+
D1-
  Bottom 1.016: D1-.1 TEENSY_3.6.D-
D+
  Bottom 0.406: USB-B.D+ 7.77,88.76 9.25,90.25 11.1,90.25 14.58,86.77 19.21,86.77 19.96,86.01 19.96,84.81 22.4,82.37 22.4,80.37 22.94,79.83 25.77,79.83 27.33,78.27 27.33,70.23 28.86,68.71 D+.1
D-
  Bottom 0.406: USB-B.D- 7.77,86.47 9.27,84.98 11.05,84.98 11.83,84.2 19.31,84.2 21.59,81.92 21.59,80.01 22.61,78.99 25.44,78.99 26.48,77.95 26.48,69.13 28.93,66.67 D-.1
DAC0
  Bottom 1.016: DAC0.1 TEENSY_3.6.A21
DAC1
  Bottom 1.016: DAC1.1 TEENSY_3.6.A22
DC  (via drill 0.35)
  Top 0.305: DC.1 36.63,52.45 37.26,53.09 37.26,55.65 36.65,56.26 33.49,56.26 32.03,57.72 32.03,60.48 23.55,68.96 13.97,68.96 12.29,67.28 v12.29,67.07 12.29,65.87 11.53,65.1 10.34,65.1 9.53,63.87 8.43,63.87 U$2.DC 7.32,64.89 4.52,67.69 U$3.DC | U$5.DC 10.33,76.53 U$1.DC
  Bottom 0.305: U$1.DC 11.05,76.53 12.39,75.19 12.39,67.17 v12.29,67.07
  Bottom 1.016: TEENSY_3.6.4 DC.1
DIN
  Top 0.305: TEENSY_3.6.11 33.4,70.74 23.52,70.74 20.22,74.04 16.07,74.04 12.98,70.95 10.92,70.95 10.92,71.43 | U$1.SDA 10.92,71.43 | U$3.DIN 4.56,75.31 7.36,72.51 U$2.DIN 7.41,72.05 9.02,70.44 U$5.SDA 9.2,69.96 9.46,69.96 10.92,71.43
  Bottom 1.016: TEENSY_3.6.11 MOSI.1
DMXEN
  Bottom 0.305: SP485CNL.3 43.79,74.07 44.04,74.32 44.04,75.74 43.61,76.17 40.92,76.17 38.68,73.94 38.68,48.59 37.16,47.07 34.21,47.07 TEENSY_3.6.2
  Bottom 0.508: SP485CNL.3 SP485CNL.2
DMXIN
  Bottom 0.406: SP485CNL.1 42.22,71.63 41.45,71.63 40.31,70.48 40.31,47.95 34.65,42.29 TEENSY_3.6.0
DMXIN.
  Bottom 0.508: DMX2.1 53.72,73.08 53.44,72.8 SP485CNL.7 46.99,72.8 45.44,74.35 45.44,75.58 43.98,77.04 42.75,77.04 36.85,82.93 36.85,86.72 DMX-OUT.2
DMXOUT
  Bottom 0.406: SP485CNL.4 42.19,75.46 41.48,75.46 39.5,73.48 39.5,48.28 36.04,44.83 TEENSY_3.6.1
DMXOUT.
  Bottom 0.508: 3.1 51.51,75.69 49.89,74.07 SP485CNL.6 48.36,73.97 47.5,73.97 46.69,74.78 46.69,76.15 47.23,76.7 47.23,80.17 46.44,80.96 42.61,80.96 DMX-OUT.3
DOUT
  Bottom 0.508: 32.41,7.62 32.41,7.47 25.93,7.47 24.49,6.02 24.49,4.52 26.59,2.41
  Bottom 0.813: NEOPIXEL-DATAOUT.1 32.38,19.94 32.41,19.94 32.41,7.62 39.75,7.62 40.89,6.48 40.89,3.81 39.5,2.41 U$7.DOUT | DOUT.1 26.59,2.41
ENC1A  (via drill 0.35)
  Top 0.305: v37.64,62.83 37.9,62.83 39.85,60.88 39.85,53.4 41.29,51.96 42.56,51.96 43.18,52.58 51.54,52.58 51.63,52.49 v51.63,52.37 | TEENSY_3.6.24 33.92,77.86 47NC2.1
  Bottom 0.305: v51.63,52.37 51.63,49.88 47.65,45.9 47.65,44.94 47.27,44.56 220R3.2 47.28,44.67 | TEENSY_3.6.24 35.69,77.85 37.3,76.24 37.3,64.99 36.83,64.52 36.83,63.59 37.59,62.83 v37.64,62.83
ENC1A.
  Bottom 0.61: 220R3.1 47.27,42.54 45.71,40.43
  Bottom 1.016: 45.71,40.43 ENC1.A
ENC1B  (via drill 0.35)
  Top 0.305: v49.35,43.99 48.38,43.99 48.02,43.63 36.82,43.63 35.8,44.65 v35.8,45.88 | TEENSY_3.6.28 35.36,89.46 35.36,91.85 35.7,92.19 35.7,93.47 47NC1.1
  Bottom 0.305: 220R2.2 49.9,44.54 v49.35,43.99 | v35.8,45.88 35.8,46.11 33.31,46.11 32.66,46.77 32.66,81.23 33.08,81.66 34.63,81.66 35.2,82.23 35.2,83.48 34.48,84.2 33.26,84.2 32.64,84.82 32.64,85.93 33.91,87.2 TEENSY_3.6.28
ENC1B.
  Bottom 0.61: 220R2.1 50.75,40.26
  Bottom 1.016: ENC1.B 50.75,40.26
ENC1BL  (via drill 0.35)
  Top 0.305: v42.16,69.34 42.02,69.2 38.05,73.18 38.05,79.58 v37.82,79.76
  Bottom 0.305: TEENSY_3.6.29 33.91,90 35.13,88.78 35.13,85 35.97,84.16 35.97,81.61 v37.82,79.76 | 100R3.2 50.27,50.31 49.17,49.21 47.04,49.21 41.96,54.29 41.96,69.31 41.99,69.34 v42.16,69.34
ENC1BL.
  Bottom 0.305: ENC1.4 100R3.1
ENC1GN
  Top 0.305: TEENSY_3.6.36/A17 18.67,90.51 16.04,87.88 16.04,82.69 16.99,81.74 19.23,81.74 20.57,80.39 20.57,77.24 24.02,73.8 27.52,73.8 30.3,76.58 36.52,76.58 37.3,75.81 37.3,72.03 38.28,71.06 100R2.2
ENC1GN.
  Top 0.305: ENC1.2 46.26,54.78 46.62,55.14 46.62,60.52 47.83,61.72 54.43,61.72 55.04,62.33 55.04,68.71 54.42,69.33 50.69,69.33 50.37,69.65 43.8,69.65 42.55,68.39 39.14,68.39 100R2.1 38.28,69.22
ENC1RT
  Top 0.305: 41.57,56.26 100R1.2 41.27,56.48 41.27,61.84 38.17,64.94 37.25,64.94 36.19,63.88 33.24,63.88 32.66,64.45 32.66,68.26 33.38,68.97 36.72,68.97 37.22,69.48 37.22,70.98 36.72,71.49 27.95,71.49 26.28,73.16 23.74,73.16 19.93,76.97 19.93,78.5 19.29,79.13 16.07,79.13 15.35,79.84 15.35,88.19 17.35,90.18 17.35,91.81 18.63,93.09 TEENSY_3.6.35/A16
ENC1RT.
  Top 0.305: 100R1.1 42.01,54.75 ENC1.1
ENC1SW  (via drill 0.35)
  Top 0.305: v45.72,71.02 45.7,70.99 41.17,70.99 38.73,73.43 38.73,80.16 37.21,81.69 37.21,82.08 36.2,83.09 47NC6.1 36.04,83.34 TEENSY_3.6.27
  Bottom 0.305: 220R1.2 46.49,70.29 45.77,71.02 v45.72,71.02
ENC1SW.
  Bottom 0.305: 220R1.1 44.79,69.53 42.62,67.36 42.62,62.41 44.09,60.94 45.28,60.94 46.62,59.59 46.62,57.3 48.26,55.67 ENC1.3 48.23,54.73 10KR1.2
ENC2A
  Top 0.305: TEENSY_3.6.32/A13 34.11,97.97 47NC4.1
  Bottom 0.305: 33.61,98.18 TEENSY_3.6.32/A13 33.72,98.17 32.08,96.53 32.08,88.8 29.95,86.67 22.61,86.67 22.01,87.27 21.97,87.27 19.86,89.38 19.86,93.58 19.1,94.35 10.76,94.35 1.46,85.05 1.46,53.65 2.62,52.48 6.67,52.48 7.67,51.49 7.67,50.55 7.22,50.07 7.22,42.72 220R6.2
ENC2A.
  Bottom 0.508: 220R6.1 5.45,42.47 5.12,42.14 ENC2.A
ENC2B  (via drill 0.35)
  Top 0.305: v36.08,88.56 35.9,88.39 35.9,88.26 34.4,86.76 33.41,86.76 32.63,85.97 32.63,84.42 25.91,77.7 25.91,76.62 v24.8,75.52 | 47NC3.1 34.16,95.89 TEENSY_3.6.31/A12
  Bottom 0.305: v36.08,88.56 36.08,88.79 35.2,89.67 35.2,94.34 TEENSY_3.6.31/A12 | 220R5.2 16.95,42.55 17.96,43.55 19.39,43.55 20.12,44.27 22.4,44.27 23,44.87 23,51.19 25.73,53.92 25.73,63.58 24.03,65.28 24.03,74.75 v24.8,75.52
ENC2B.
  Bottom 0.508: 220R5.1 10.12,42.24 ENC2.B
ENC2BL  (via drill 0.35)
  Top 0.305: v15.07,59 v15.08,59.01 14.98,58.91 12.74,58.91 11.75,57.91 100R4.2 | v25.04,78.08 25.27,78.08 25.27,79.5 30.12,84.35 30.12,85.95 32.7,88.53 32.7,92.28 33.52,93.09 TEENSY_3.6.30
  Bottom 0.305: v25.04,78.08 25.04,78.23 24.99,78.28 22.62,78.28 21.53,77.19 21.53,73.81 19.21,71.5 15.88,71.5 15.28,70.91 15.28,59.21 v15.08,59.01
ENC2BL.
  Top 0.305: ENC2.4 9.88,55.01 9.89,55.08 100R4.1
ENC2GN
  Bottom 0.305: TEENSY_3.6.37/A18 14.32,88.01 11.32,91.01 8.48,91.01 6.47,89 6.47,85.77 7.8,84.44 100R6.2
ENC2GN.
  Top 0.305: 5.51,55.5 ENC2.2
  Bottom 0.305: ENC2.2 5.62,55.64 7.2,57.22 7.2,60.11 5.97,61.34 2.92,61.34 2.16,62.1 2.16,81.66 2.74,82.25 7.24,82.25 7.43,82.38 100R6.1
ENC2RT  (via drill 0.35)
  Top 0.305: TEENSY_3.6.38/A19 18.67,85.27 16.82,83.42 16.82,83.39 v16.9,83.31
  Bottom 0.305: v16.9,83.31 14.62,83.31 100R5.2
ENC2RT.  (via drill 0.35)
  Top 0.305: ENC2.1 3.53,53.82 4.86,52.49 12.25,52.49 13.1,53.34 13.1,57.57 v13.48,57.95
  Bottom 0.305: 100R5.1 12.69,82.93 13.92,81.7 13.92,61.18 13.48,60.75 v13.48,57.95
ENC2SW  (via drill 0.35)
  Top 0.305: v14.4,59.87 12.74,59.87 11.89,59.02 220R4.2
  Bottom 0.305: 18.68,82.97 18.64,82.93 TEENSY_3.6.39/A20 | TEENSY_3.6.39/A20 20.37,81.23 20.45,81.17 47NC5.1 | v14.4,59.87 14.61,59.87 14.61,81.32 15.71,82.43 18.52,82.43 18.67,82.58 TEENSY_3.6.39/A20
ENC2SW.
  Top 0.305: ENC2.3 7.62,55.71 7.64,55.74 7.64,56.86 220R4.1
  Bottom 0.305: 10KR2.2 7.87,57.47 7.87,55.26 7.62,55.01 ENC2.3
FSR
  Bottom 0.305: OPA348,.1 10.55,46.02 11.47,45.1 16.14,45.1 17.44,46.4 17.44,48.64 17.4,48.64 | 100R7.1 13.79,50.3 15.46,48.64 17.4,48.64 | TEENSY_3.6.22/A8 17.4,48.64
GND.  (via drill 0.35)  (82 unrouted)
  Top 0.305: U$5.GND 8.29,63.25
  Top 0.508: OPA348..2 40.23,87.88
  Top 0.813: 11.18,88.52 USB-B.GND 9.4,88.52
  Bottom 0.61: SP485CNL.5 48.64,75.51
  Bottom 0.813: 11.18,88.52 USB-B.GND 9.44,88.52
  other vias: 41.05,96.8 51.05,16.51 11.43,25.4 27.94,34.54 46.35,51.56 53.47,51.94 48.01,63.53 35.74,65.1 36.93,89.33 27.94,38.35 38.35,38.35 30.73,74.68 21.08,38.35 51.05,25.4 51.05,7.62 4.32,25.4 4.83,7.62 11.68,16.51 29.54,79.96 17.02,25.4 21.59,25.4 25.91,25.15 34.54,25.15 43.69,25.15 39.93,85.29 38.18,92.41 21.64,78.59 10.92,92.33 30.81,67.77 21.34,45.49 4.06,16.51 24.64,16.76 36.83,33.78 10.67,80.9 13.46,96.14
  pour Top: 0,0 0,100.33 55.88,100.33 55.88,0
  pour Bottom: 0,0 0,100.33 55.88,100.33 55.88,0
MIC
  Top 0.508: MIC.2 52.55,81.02 52.55,82.8 | 4.7µFC1.2 52.55,84.55 52.55,82.8 | 52.55,82.8 2K2R1.1
MIDIIN
  Top 0.406: 43.43,65.25 4N28.5 43.43,65.59 42.22,66.8 35.56,66.8 TEENSY_3.6.9 | 43.43,65.46 44.8,66.8 47.02,66.8 51.16,62.7 3K3R1.2 51.59,62.98 MIDIIN.1
  Top 0.508: 4N28.5 43.43,65.46
MIDIIN.
  Top 0.406: 4N28.2 40.81,77.34 D27.A 41.02,77.34 MIDIIN5.1
MIDIINGND
  Top 0.406: 220R11.2 47.35,77.33 45.73,77.33 D27.C 45.72,74.98 4N28.1
MIDIOUT
  Top 0.406: TEENSY_3.6.10 33.98,67.61 42.93,67.61 44.29,68.97 49.9,68.97 50.8,68.07 MIDIOUT..1
  Bottom 0.305: MIDIOUT..1 51.44,67.82
  Bottom 0.406: MIDIOUT.1 51.44,67.82
MISO
  Top 0.305: 33.76,72.77 TEENSY_3.6.12 33.78,72.64 D26.C D25.C
  Bottom 1.016: ROW5.1 TEENSY_3.6.12
N$1
  Top 0.305: 100R8.1 41.42,87.12
  Top 0.61: DMX-OUT.1 44.2,87.12 41.42,87.12
  Bottom 0.508: DMX-OUT.G 48.89,91.82 DMX-OUT.1
N$2
  Top 0.305: D1.C 46.06,33.2 46.71,33.85 49.78,33.85 52.43,36.49 SR1.1
N$3
  Bottom 0.305: SR2.1 52.25,28.65
  Bottom 0.813: 52.25,28.65 D2.C
N$4
  Bottom 0.305: 52.19,19.84 52.39,19.81 52.43,19.77 SR3.1
  Bottom 0.813: 52.19,19.84 51.08,20.95 D3.C
N$5
  Bottom 0.305: OPA348,.4 8.65,49.51 11.25,52.11 100R7.2 14.03,52.11 16.12,50.02 FSR.1
N$6
  Bottom 0.305: SR4.1 52.23,10.87
  Bottom 0.813: D4.C 52.23,10.87
N$7
  Bottom 0.813: D5.C 43.81,31.83 44.02,32.03 S4.4
N$8
  Top 0.813: S8.4 38.02,26.21 D6.C
N$9
  Bottom 0.305: D7.C 38.92,20.7 40.13,19.49 40.13,17.12 43,14.25 S12.4
N$10
  Bottom 0.813: S16.4 38.53,9.88 38.73,10.08 D8.C
N$11
  Bottom 0.813: D9.C 34.92,31.83 35.13,32.03 S3.4
N$12
  Top 0.813: S7.4 29.13,26.21 D10.C
N$13
  Bottom 0.813: D11.C 35.64,14.68 S11.4
N$14
  Bottom 0.813: S15.4 29.64,9.88 29.84,10.08 D12.C
N$15
  Bottom 0.813: D13.C 26.04,31.83 26.24,32.03 S2.4
N$16
  Bottom 0.813: D14.C 20.24,26.21 S6.4
N$17
  Bottom 0.813: D15.C 26.75,14.68 S10.4
N$18
  Bottom 0.813: S14.4 20.75,9.88 20.95,10.08 D16.C
N$19
  Bottom 0.813: D17.C 17.14,31.83 17.35,32.03 S1.4
N$20
  Bottom 0.305: D18.C 12.13,20.95 13.46,22.29 13.46,27.03 12.83,27.66 S5.4
N$21
  Bottom 0.813: D19.C 17.86,14.68 S9.4
N$22
  Bottom 0.813: S13.4 11.86,9.88 12.06,10.08 D20.C
N$23
  Bottom 0.305: SL1.2 3.45,36.34 5.94,33.85 9.02,33.85 9.46,33.4 D21.C
N$24
  Bottom 0.813: D22.C 3.63,28.65 SL2.2
N$25
  Bottom 0.813: D23.C 3.63,19.76 SL3.2
N$26
  Bottom 0.813: SL4.2 3.63,10.87 D24.C
N$27
  Top 0.508: 4N28.6 45.81,65.27 100KR3.1
N$28
  Top 0.406: MIDIIN4.1 47.38,79.5 220R11.1
N$29  (via drill 0.35)
  Top 0.305: SHIFT2.3 46.36,94.49 v46.33,94.49 46.36,94.49 SHIFT2.4
  Bottom 0.305: D26.A 31.37,77.72 31.37,83.66 30.12,84.9 30.12,85.95 32.69,88.52 32.69,96.18 33.41,96.9 36.38,96.9 38.77,94.51 46.3,94.51 v46.33,94.49 46.35,94.49
N$30  (via drill 0.35)
  Top 0.305: v11.35,93.47 11.35,97.94 10.87,98.42 6.51,98.42 5.62,97.54 SHIFT1.3 SHIFT1.4
  Bottom 0.305: D25.A 28.52,78.21 26.21,80.52 23.37,80.52 23.14,80.75 23.14,82.61 22.55,83.2 22.55,85.81 19.16,89.2 17.98,89.2 17.27,89.92 17.27,92.55 16.12,93.7 11.58,93.7 v11.35,93.47
N$51
  Top 0.305: OPA348..4 41.23,91.7 44.86,91.7 45.24,91.32 45.24,89.94 46.36,88.82 51.85,88.82 52.22,89.34 52.22,90.61 52.98,91.38 10KR4.1
  Top 0.508: 820KR1.2 41.18,94.72 OPA348..4
N$52
  Top 0.508: 10KR4.2 53.24,87.43 4.7µFC1.1
N$56
  Top 0.305: 10KR3.1 49.54,87.33 48.68,88.19 46.04,88.19 43.93,90.29
  Top 0.508: 10KR3.1 10KR5.1 | OPA348..3 41.21,89.15 42.05,89.99 42.95,89.99 4.7µFC2.2 43.93,90.29
NEO
  Bottom 0.406: TEENSY_3.6.23/A9 19.96,48.66 19.96,50.5 19.29,51.18 17.65,51.18 17.25,51.59 16.2,51.59 13.11,54.69 13.11,56.31 12.45,56.97 12.45,60.64 13.21,61.4 13.21,80.55 10.49,83.26 U$4.DIN
PGM
  Bottom 0.305: PGM.1 PGM.2
  Bottom 0.508: PGM.1 24,83.48 24,85.22 TEENSY_3.6.PGM
ROW1  (via drill 0.35)
  Top 0.305: v20.54,64.15 21.2,64.81 23.34,64.81 24.98,63.17 24.98,51.63 v24.75,51.63
  Top 1.016: SL1.4 7.98,36.55 S1.1
  Bottom 0.305: TEENSY_3.6.14/A0 19,70.23 19.98,69.25 19.98,64.71 v20.54,64.15 | S1.1 12.88,36.55 15.11,38.79 15.11,40.39 15.79,41.06 19.43,41.06 19.95,41.58 19.95,42.99 20.57,43.61 22.78,43.61 24.09,44.92 24.09,51 24.73,51.63 v24.75,51.63
  Bottom 1.016: ROW1.1 TEENSY_3.6.14/A0
ROW1'
  Bottom 0.813: S3.2 S4.1
ROW1,
  Bottom 0.813: S2.2 S3.1
ROW1.
  Bottom 0.813: S1.2 S2.1
ROW1`
  Top 1.016: S4.2 47.9,36.55 SR1.3
ROW2
  Bottom 0.813: SL2.3 7.98,23.14 S5.2
ROW2'
  Top 0.305: S8.2 38.1,23.18 38.1,23.14
  Top 1.016: S8.2 38.1,23.14 38.46,23.14 38.73,22.86
  Bottom 0.813: S7.1 S8.2
ROW2,  (via drill 0.35)
  Top 0.305: TEENSY_3.6.15/A1 18.68,67.7 23.94,67.7 31.12,60.52 v31.12,59.09 | S6.1 25.82,23.14 23.81,25.15 23.81,32.51 24.65,33.35 29.96,33.35 v31.1,34.49
  Bottom 0.305: v31.1,34.49 31.11,34.51 31.11,37.44 29.84,38.71 29.84,43.2 31.93,45.29 31.93,58.29 31.13,59.09 v31.12,59.09
  Bottom 0.813: S6.1 S7.2
  Bottom 1.016: ROW2.1 TEENSY_3.6.15/A1
ROW2.
  Bottom 0.813: S5.1 S6.2
ROW2`
  Bottom 0.813: S8.1 47.68,23.14 47.9,22.91 SR2.4
ROW3
  Bottom 0.813: SL3.4 7.98,18.77 S9.1
ROW3'
  Bottom 0.813: S11.2 S12.1
ROW3,  (via drill 0.35)
  Top 0.305: TEENSY_3.6.16/A2 19.2,65.15 20.31,66.26 23.64,66.26 26.44,63.45 v26.44,52.23 | S10.2 26.75,20.56 23.18,24.13 23.18,36.01 v24.77,37.59
  Bottom 0.305: v26.44,52.23 26.57,52.23 26.57,45.09 27.29,44.36 27.29,40.17 24.77,37.64 v24.77,37.59
  Bottom 0.813: S10.2 S11.1
  Bottom 1.016: ROW3.1 TEENSY_3.6.16/A2
ROW3.
  Bottom 0.813: S9.2 S10.1
ROW3`
  Bottom 0.813: S12.2 47.68,18.77 47.9,19 SR3.3
ROW4  (via drill 0.35)
  Top 0.305: v8.74,44.56 3.85,44.56 2.17,42.88 2.17,35.57 5.97,31.77 5.97,7.62 7.98,5.61 SL4.3 | TEENSY_3.6.17/A3 18.67,62.15 19.88,60.95 19.88,54.19 19.41,53.72 18.16,53.72 17.4,52.96 17.4,51.69 17.91,51.18 19.3,51.18 19.99,50.49 19.99,46.55 v19.95,46.51
  Bottom 0.305: v8.74,44.56 8.87,44.44 16.54,44.44 18.22,46.13 19.57,46.13 v19.95,46.51
  Bottom 0.813: SL4.3 7.98,5.13 8.2,5.36 S13.2
  Bottom 1.016: ROW4.1 TEENSY_3.6.17/A3
ROW4'
  Bottom 0.813: S16.2 S15.1
ROW4,
  Bottom 0.813: S15.2 S14.1
ROW4.
  Bottom 0.813: S14.2 S13.1
ROW4`
  Bottom 0.813: SR4.4 47.9,5.13 47.68,5.36 S16.1
RST
  Top 0.305: TEENSY_3.6.5 33.71,54.99 33.71,55.18 30.29,58.6 30.29,60.49 23.72,67.06 19.98,67.06 19.35,66.43 16.14,66.43 11.05,61.34 8.42,61.34 U$2.RST 7.33,62.35 4.53,65.15 U$3.RST | U$5.RES 9.27,72.68 10.59,73.99 U$1.RES
  Bottom 0.305: U$5.RES 9.02,72.2 8.05,71.23 6.86,71.23 6.22,70.59 6.22,66.92 U$3.RST
  Bottom 1.016: TEENSY_3.6.5 RST.1
RX3  (via drill 0.35)
  Top 0.305: v36.68,48.18 36.83,48.03 36.83,47.2 37.06,46.98 220R10.1
  Bottom 0.305: v36.68,48.18 36.68,49.45 37.25,50.02 37.25,58.76 RX3.1
  Bottom 1.016: RX3.1 TEENSY_3.6.7
RX3.
  Top 0.305: 220R10.2 38.19,44.3 47.61,44.3 48.21,44.9 50.61,44.9 53.8,41.71 53.8,35.46 52.98,34.65 51.59,34.65 49.2,32.26 49.2,2.54 48.39,1.73 42.31,1.73 40.13,3.91 37.16,3.91 35.66,2.41 RX3..1
SCK
  Top 0.305: SCK.1 15.75,72.77 11.91,68.94 10.94,68.94 U$1.SCL 10.38,68.91 9.06,67.58 9.02,67.62 | U$3.SCK 4.53,72.77 7.33,69.97 U$2.CLK 7.41,69.59 9.02,67.98 9.02,67.62 | 9.02,67.62 U$5.SCL
  Bottom 1.016: SCK.1 TEENSY_3.6.13
SCL  (via drill 0.35)
  Top 0.305: SCL.1 15.6,57.53 13.81,55.75 13.81,52.94 12.73,51.86 6.33,51.86 5,50.53 v5,50.32
  Bottom 0.305: v5,50.32 5.13,50.19 5.13,46.38 2.13,43.38 2.13,35.54 3,34.67 4.16,34.67 6.66,32.18 6.66,26.53 220R8.2
  Bottom 1.016: TEENSY_3.6.19/A5 SCL.1
SCL.
  Bottom 0.305: 220R8.1 6.71,24.22 6.71,3.83 8.13,2.41 SCL..1
SDA  (via drill 0.35)
  Top 0.305: v4.07,50.95 4.05,50.95 2.13,52.88 2.13,60.58 2.9,61.34 5.49,61.34 6.81,60.02 11.94,60.02 12.68,60.76 15.95,60.76 SDA.1
  Bottom 0.305: 5.89,17.61 220R7.2 5.97,17.69 5.97,23.11 5.33,23.75 5.33,26.98 5.97,27.61 5.97,31.88 3.89,33.96 2.74,33.96 1.45,35.26 1.45,43.77 4.39,46.72 4.39,49.51 4.06,49.84 v4.06,50.95 v4.07,50.95
  Bottom 1.016: TEENSY_3.6.18/A4 SDA.1
SDA.
  Bottom 0.305: 220R7.1 6.02,15.28 6.02,2.77 6.35,2.44 SDA..1
TX3  (via drill 0.35)
  Top 0.305: 220R9.1 39.24,47.12 37.59,48.77 v37.59,48.9
  Bottom 0.305: v37.59,48.9 37.59,48.92 37.97,49.3 37.97,60.58 TX3.1
  Bottom 1.016: TX3.1 TEENSY_3.6.8
TX3.
  Top 0.305: 220R9.2 39.24,45.23 39.54,44.93 47.24,44.93 47.93,45.62 50.88,45.62 54.48,42.01 54.48,35.1 53.35,33.96 51.94,33.96 49.89,31.9 49.89,2.13 48.74,0.99 30.63,0.99 TX3..1
V1
  Bottom 1.016: V+.1 TEENSY_3.6.VUSB1
VUSB  (via drill 0.35)
  Top 0.305: v51.56,65.66 51.56,64.66 3K3R1.1 | 13.96,50.27 13.94,50.25 13.94,50.17
  Top 0.508: 10KR5.2 2K2R1.2 47.84,80.96 | 47.84,80.96 48.86,80.96 48.86,71.16 49.4,70.61 +5V,.1 | 47.84,80.96 40.1,80.96 38.86,82.19 38.86,87.61 38.32,88.14 38.32,90.46 39.28,91.42 OPA348..5 | 20.98,39.75 21.24,39.5 31.42,39.5 31.5,39.42 v31.52,39.42 | 15.6,48.44 15.6,47.35 +5V_FSR.1 16.05,47.98 15.6,48.44 | 15.6,48.44 13.86,50.17
  Top 0.61: 10.65,49.1 10.29,49.1 10.29,48.92
  Top 1.016: USB-B.VBUS 10.16,86.54 7.93,84.3 7.93,82.6 5.72,80.39 U$3.VCC 2.67,80.39 1.14,78.87 1.14,52.15 4.18,49.1 10.29,49.1 | 14.61,39.75 13.84,39.75 U$7.+5V 13.46,43.75 10.47,46.74 10.47,48.74 10.29,48.92 | U$4.V+. 16.18,52.49 13.96,50.27 | 10.65,49.1 11.72,50.17 v11.94,50.17 13.86,50.17 13.94,50.17 | 14.61,39.75 VIN.1 TEENSY_3.6.VIN | TEENSY_3.6.VIN 21.21,39.75 TEENSY_3.6.VUSB | TEENSY_3.6.VIN 20.98,39.75 | 14.61,39.75 14.61,2.41 +5V..1 U$7.+5V. +5V.1
  Bottom 0.305: OPA348,.5 10.55,49.13 11.6,50.17 v11.94,50.17
  Bottom 0.406: 50.12,70.61 50.12,67.09 v51.55,65.66 v51.56,65.66
  Bottom 0.508: v31.52,39.42 31.52,39.31 32.84,38 36.32,38 44.88,46.56 44.88,48.74 41.17,52.45 41.17,69.88 41.71,70.41 43.59,70.41 45.16,71.98 46.18,71.98 46.63,71.53 SP485CNL.8 48.56,71.42 49.23,71.42 50.04,70.61 50.12,70.61 +5V,.1 +.1
  Bottom 0.813: U$2.VCC 4.61,80.39 U$3.VCC

### Text on the board
tNames: COL2 | COL3 | DOUT | 1.44" | Connect | air wire | DOUT | to DIN | 1.3" 240 (no CS) | Waveshare 1.3" LCD 240 | OLED 1.5" 128 | MIDI | Connect air wire USB D+ and USB D- | to Teensy USB pads (below micro-USB) | AIN | Teensy 3.6 | RGB ENC | RGB ENC | DIN
bNames: Neo / DIN | V+ | MIDI-in | BLK | GND | DC | DMX in | v3.2 | DIN | RES | SCK | 2 | MIDIout | SDA | CS | Neo- / GND | SCL | DC | GND | VCC | O | RST | by DJ Yoi | BL | GND | I | Counter | MIDI Beat | Neo / +5v | 2nd USB | VUSB | Cut at this line if no MIDI keys are needed